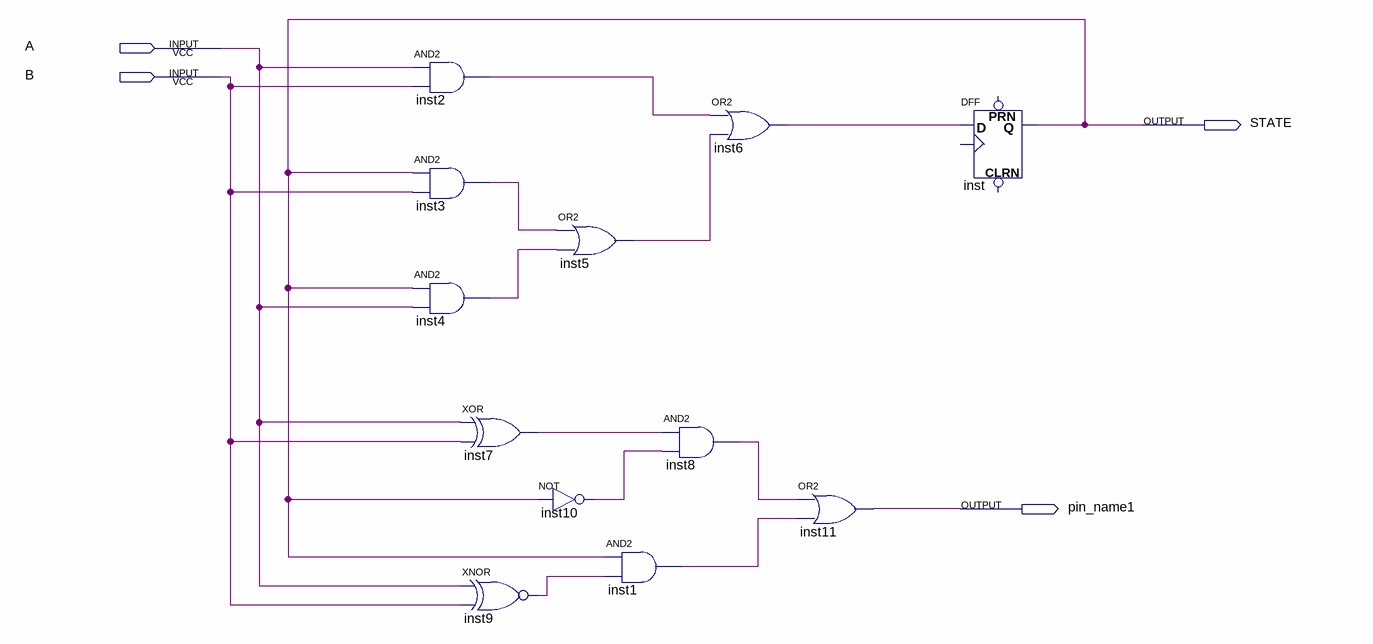
[diagram p0: schematic sheet]
// Quartus schematic Part2.bdf as structural Verilog: 12 symbols, 4 pins
module Part2 (
  input  A,
  input  B,
  output STATE,
  output pin_name1
);

  wire inst1_out, inst2_out, inst3_out, inst4_out, inst5_out, inst6_out, inst7_out, inst8_out, inst9_out,
       inst10_out;

  and inst2 (inst2_out, A, B);
  and inst3 (inst3_out, STATE, B);
  and inst4 (inst4_out, STATE, A);
  xor inst7 (inst7_out, A, B);
  xnor inst9 (inst9_out, A, B);
  or inst5 (inst5_out, inst3_out, inst4_out);
  not inst10 (inst10_out, STATE);
  and inst1 (inst1_out, STATE, inst9_out);
  or inst6 (inst6_out, inst2_out, inst5_out);
  and inst8 (inst8_out, inst7_out, inst10_out);
  or inst11 (pin_name1, inst8_out, inst1_out);
  DFF inst (.D(inst6_out), .Q(STATE));  // open: CLRN, CLK, PRN
endmodule
